# EAGLE design ph_v5 (EAGLE 7.5.0)
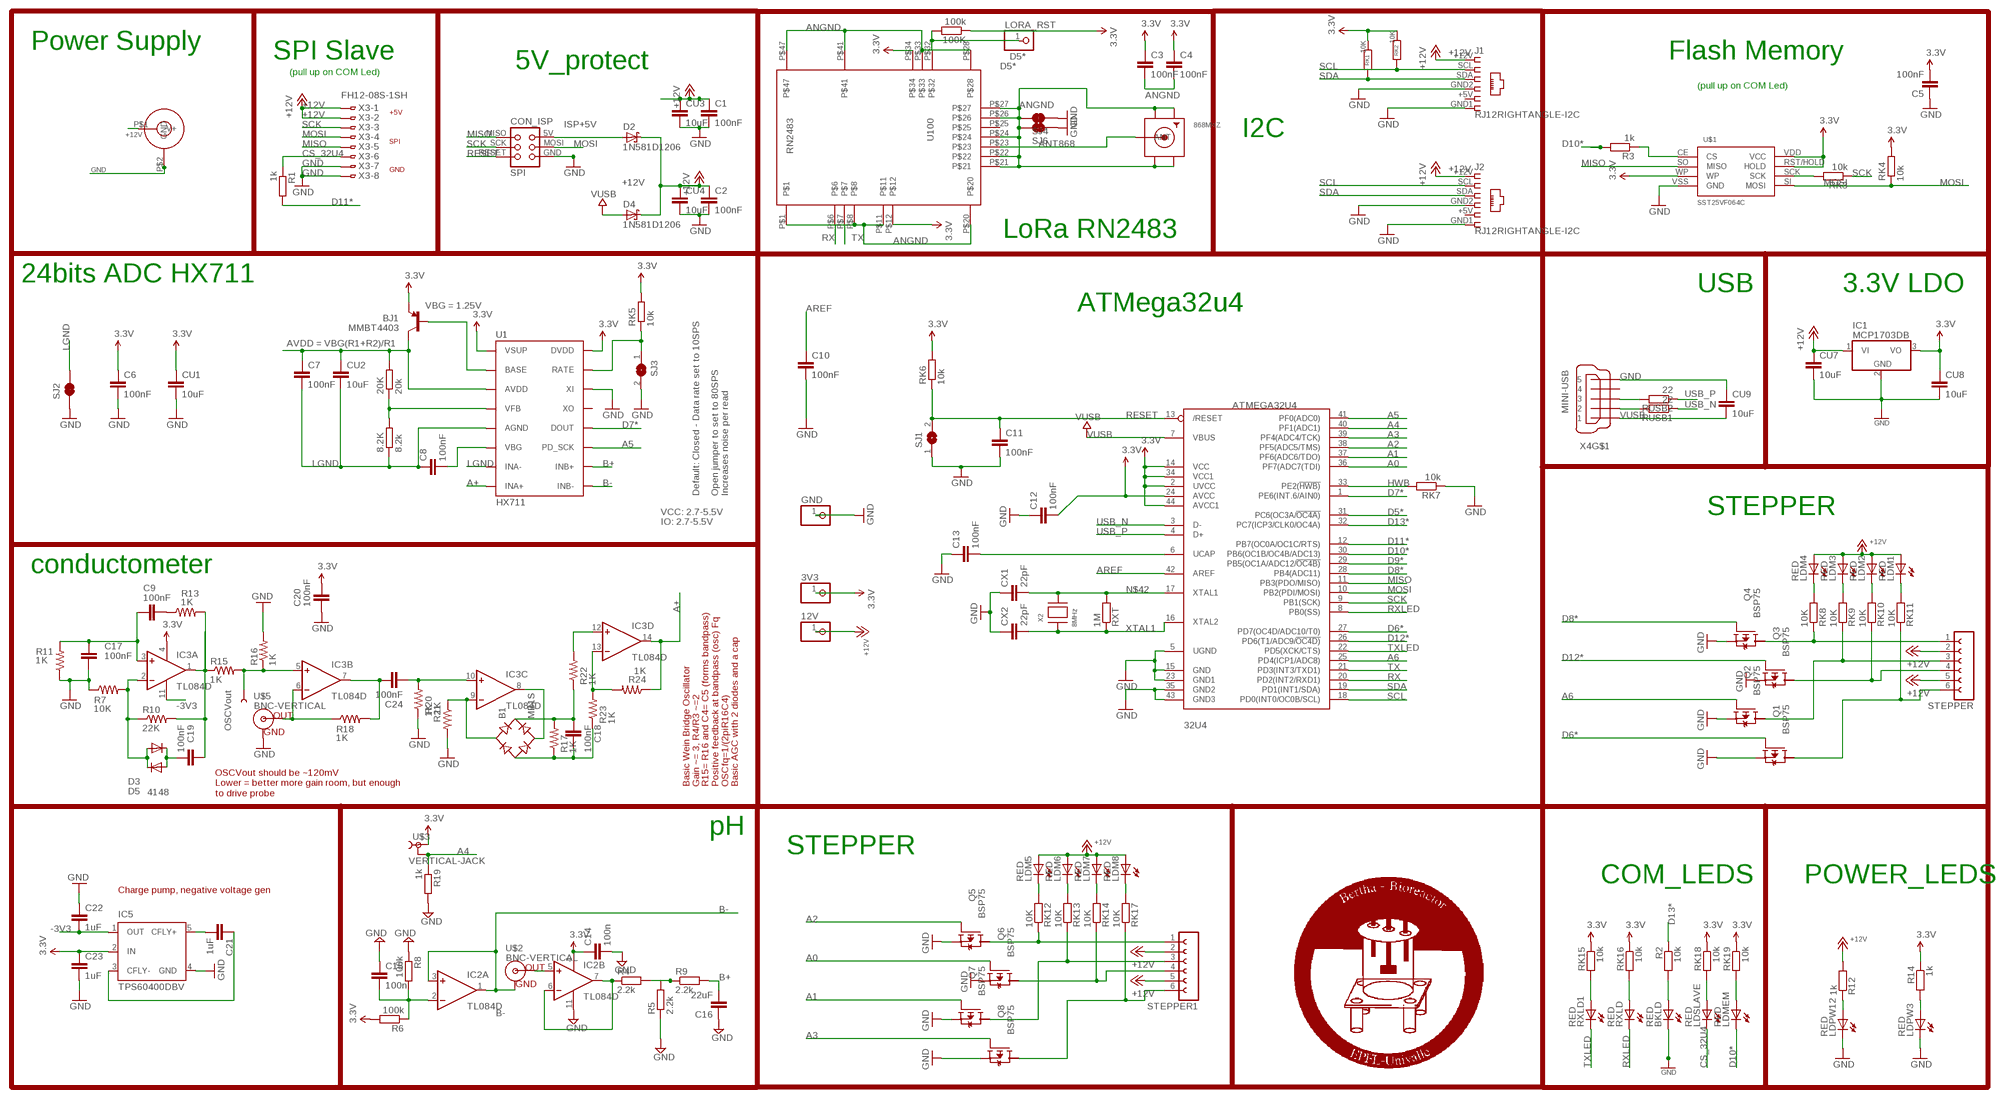
[diagram p0: schematic, sheet 1]

## Parts
3V3  PINHD-1X1  [1X01]
8.2K  8.2k  R-EU_M0805  [M0805]
12V  PINHD-1X1  [1X01]
20K  20k  R-EU_M0805  [M0805]
32U4  ATMEGA32U4  ATMEGA32U4-AU  [TQFP44]
100K  100k  R-EU_R0805  [R0805]
868MHZ  SMACONNECTOR_EDGE  [SMA_EDGELAUNCH]
B1  MB1S  [SOIC-4]
BJ1  MMBT4403  TRANSISTOR_PNPMMBT4403  [SOT23-3]
BKLD  RED  LEDCHIP-LED0805  [CHIP-LED0805]
C1  100nF  C-EUC1206  [C1206]
C2  100nF  C-EUC1206  [C1206]
C3  100nF  C-EUC1206  [C1206]
C4  100nF  C-EUC1206  [C1206]
C5  100nF  C-EUC1206  [C1206]
C6  100nF  C-EUC1206  [C1206]
C7  100nF  C-EUC1206  [C1206]
C8  100nF  C-EUC1206  [C1206]
C9  100nF  CAP1206  [1206]
C10  100nF  C-EUC1206  [C1206]
C11  100nF  C-EUC1206  [C1206]
C12  100nF  C-EUC1206  [C1206]
C13  100nF  C-EUC1206  [C1206]
C14  100n  C-EUC1206  [C1206]
C15  100n  C-EUC1206  [C1206]
C16  22uF  C-EUC1206  [C1206]
C17  100nF  CAP1206  [1206]
C18  100nF  CAP1206  [1206]
C19  100nF  CAP1206  [1206]
C20  100nF  CAP1206  [1206]
C21  1uF  CAP1206  [1206]
C22  1uF  CAP1206  [1206]
C23  1uF  CAP1206  [1206]
C24  100nF  CAP1206  [1206]
CON1  JACK_DC_BARREL  [DC_BARREL]
CON_ISP  SPI  TINYISPT  [TC2030-MCP-NL]
CU1  10uF  C-EUC1206  [C1206]
CU2  10uF  C-EUC1206  [C1206]
CU3  10uF  C-EUC1206  [C1206]
CU4  10uF  C-EUC1206  [C1206]
CU7  10uF  C-EUC1206  [C1206]
CU8  10uF  C-EUC1206  [C1206]
CU9  10uF  C-EUC1206  [C1206]
CX1  22pF  C-EUC1206  [C1206]
CX2  22pF  C-EUC1206  [C1206]
D2  1N581D1206  [LED-1206]
D3  4148  MBR0520LT  [SOD123]
D4  1N581D1206  [LED-1206]
D5  4148  MBR0520LT  [SOD123]
GND  PINHD-1X1  [1X01]
IC1  MCP1703DB  [SOT223]
IC2  TL084D  [SO14]
IC3  TL084D  [SO14]
IC5  TPS60400DBV  [SOT23-DBV]
J1  RJ12RIGHTANGLE-I2C  [RJ12-RIGHTANGLE-I2C]
J2  RJ12RIGHTANGLE-I2C  [RJ12-RIGHTANGLE-I2C]
LDM1  RED  LEDCHIP-LED0805  [CHIP-LED0805]
LDM2  RED  LEDCHIP-LED0805  [CHIP-LED0805]
LDM3  RED  LEDCHIP-LED0805  [CHIP-LED0805]
LDM4  RED  LEDCHIP-LED0805  [CHIP-LED0805]
LDM5  RED  LEDCHIP-LED0805  [CHIP-LED0805]
LDM6  RED  LEDCHIP-LED0805  [CHIP-LED0805]
LDM7  RED  LEDCHIP-LED0805  [CHIP-LED0805]
LDM8  RED  LEDCHIP-LED0805  [CHIP-LED0805]
LDMEM  RED  LEDCHIP-LED0805  [CHIP-LED0805]
LDPW3  RED  LEDCHIP-LED0805  [CHIP-LED0805]
LDPW12  RED  LEDCHIP-LED0805  [CHIP-LED0805]
LDSLAVE  RED  LEDCHIP-LED0805  [CHIP-LED0805]
LORA_RST  PINHD-1X1  [1X01]
Q1  BSP75  BSP613P  [PG-SOT-223]
Q2  BSP75  BSP613P  [PG-SOT-223]
Q3  BSP75  BSP613P  [PG-SOT-223]
Q4  BSP75  BSP613P  [PG-SOT-223]
Q5  BSP75  BSP613P  [PG-SOT-223]
Q6  BSP75  BSP613P  [PG-SOT-223]
Q7  BSP75  BSP613P  [PG-SOT-223]
Q8  BSP75  BSP613P  [PG-SOT-223]
R1  1k  R-EU_R0805  [R0805]
R2  10k  R-EU_R0805  [R0805]
R3  1k  R-EU_R0805  [R0805]
R4  2.2k  R-EU_R0805  [R0805]
R5  2.2k  R-EU_R0805  [R0805]
R6  100k  R-EU_R0805  [R0805]
R7  10K  RESISTOR0805-RES  [0805]
R8  100k  R-EU_R0805  [R0805]
R9  2.2k  R-EU_R0805  [R0805]
R10  22K  RESISTOR0805-RES  [0805]
R11  1K  RESISTOR0805-RES  [0805]
R12  1k  R-EU_R0805  [R0805]
R13  1K  RESISTOR0805-RES  [0805]
R14  1k  R-EU_R0805  [R0805]
R15  1K  RESISTOR0805-RES  [0805]
R16  1K  RESISTOR0805-RES  [0805]
R17  1K  RESISTOR0805-RES  [0805]
R18  1K  RESISTOR0805-RES  [0805]
R19  1k  R-EU_R0805  [R0805]
R20  1K  RESISTOR0805-RES  [0805]
R21  1K  RESISTOR0805-RES  [0805]
R22  1K  RESISTOR0805-RES  [0805]
R23  1K  RESISTOR0805-RES  [0805]
R24  1K  RESISTOR0805-RES  [0805]
RK1  10K  R-EU_M0805  [M0805]
RK2  10K  R-EU_M0805  [M0805]
RK3  10k  R-EU_R0805  [R0805]
RK4  10k  R-EU_R0805  [R0805]
RK5  10k  R-EU_M0805  [M0805]
RK6  10k  R-EU_M0805  [M0805]
RK7  10k  R-EU_M0805  [M0805]
RK8  10K  R-EU_R0805  [R0805]
RK9  10K  R-EU_R0805  [R0805]
RK10  10K  R-EU_R0805  [R0805]
RK11  10K  R-EU_R0805  [R0805]
RK12  10K  R-EU_R0805  [R0805]
RK13  10K  R-EU_R0805  [R0805]
RK14  10K  R-EU_R0805  [R0805]
RK15  10k  R-EU_R0805  [R0805]
RK16  10k  R-EU_R0805  [R0805]
RK17  10K  R-EU_R0805  [R0805]
RK18  10k  R-EU_R0805  [R0805]
RK19  10k  R-EU_R0805  [R0805]
RUSB1  22  R-EU_M1206  [M1206]
RUSB2  22  R-EU_M1206  [M1206]
RXLD  RED  LEDCHIP-LED0805  [CHIP-LED0805]
RXLD1  RED  LEDCHIP-LED0805  [CHIP-LED0805]
RXT  1M  R-EU_R0805  [R0805]
SJ1  SJ  [SJ]
SJ2  JUMPER-PAD-2-NC_BY_TRACE  [PAD-JUMPER-2-NC_BY_TRACE_YES_SILK]
SJ3  SJ  [SJ]
SJ4  JUMPER-PAD-2-NC_BY_TRACE  [PAD-JUMPER-2-NC_BY_TRACE_YES_SILK]
SJ6  JUMPER-PAD-2-NC_BY_TRACE  [PAD-JUMPER-2-NC_BY_TRACE_YES_SILK]
STEPPER  FE06-1  [FE06]
STEPPER1  FE06-1  [FE06]
TP5  OSCVout  TEST-POINT3  [PAD.03X.03]
U1  HX711  HX711HX711  [SO16]
U100  RN2483  [RN2483]
U$1  SST25VF064C  [SOIC_8-LEAD]
U$2  BNC-VERTICAL  [BNC-VERTICAL]
U$3  VERTICAL-JACK  [VERTICAL-JACK]
U$5  BNC-VERTICAL  [BNC-VERTICAL]
X2  8MHz  XTALNX6035  [NX6035]
X3  FH12-08S-1SH  [FH12-08S-1SH]
X4  MINI-USB  MINI-USB-SCHIELD-32005-201  [32005-201]

## Nets
3.3V [power]: 3V3.1 32U4.2(UVCC) 32U4.14(VCC) 32U4.24(AVCC) 32U4.34(VCC1) 32U4.44(AVCC1) 100K.1 BJ1.2(E) C3.1 C4.1 C5.2 C6.1 C12.2 C14.1 C20.1 C23.1 CU1.1 CU8.1 IC1.3(VO) IC2.4(P:V+) IC3.4(P:V+) IC5.2(IN) R6.2 R14.1 RK1.1 RK2.1 RK4.2 RK5.2 RK6.2 RK15.1 RK16.1 RK18.1 RK19.1 U1.1(VSUP) U1.16(DVDD) U100.P$12 U100.P$34 U$1.RST/HOLD(HOLD) U$1.VDD(VCC) U$1.WP U$3.P$1
+12V [power]: 12V.1 C1.1 C2.1 CON1.P$1(V+) CU3.1 CU4.1 CU7.1 D2.C D4.C IC1.1(VI) J1.+12V J2.+12V LDM1.A LDM2.A LDM3.A LDM4.A LDM5.A LDM6.A LDM7.A LDM8.A R12.2 STEPPER1.2 STEPPER1.5 STEPPER.2 STEPPER.5 X3.1 X3.2
-3V3: C22.2 IC3.11(P:V-) IC5.1(OUT)
A0: 32U4.36(PF7(ADC7(TDI)) Q6.1(G)
A1: 32U4.37(PF6(ADC6/TDO)) Q7.1(G)
A2: 32U4.38(PF5(ADC5/TMS)) Q5.1(G)
A3: 32U4.39(PF4(ADC4/TCK)) Q8.1(G)
A4: 32U4.40(PF1(ADC1)) R19.1 U$3.P$2
A5: 32U4.41(PF0(ADC0)) U1.11(PD_SCK)
A6: 32U4.25(PD4(ICP1/ADC8)) Q2.1(G)
A+: IC3.14(D:OUT) R24.1 U1.8(INA+)
ANGND: 868MHZ.GND@1(GND4) 868MHZ.GND@2(GND3) 868MHZ.GND@3(GND2) 868MHZ.GND@4(GND1) C3.2 C4.2 SJ4.2 SJ6.2 U100.P$1 U100.P$8 U100.P$11 U100.P$20 U100.P$21 U100.P$22 U100.P$24 U100.P$26 U100.P$27 U100.P$28 U100.P$33 U100.P$41 U100.P$47
ANT868: 868MHZ.P(ANT) U100.P$23
AREF: 32U4.42(AREF) C10.1
B+: C16.2 R9.2 U1.10(INB+)
B-: IC2.1(A:OUT) IC2.3(A:+IN) U1.9(INB-) U$2.G(GND)
CN3: C8.2 U1.6(VBG)
CS_32U4: LDSLAVE.C R1.1 X3.6
D5*: 32U4.31(PC6(OC3A/!OC4A)) 100K.2 LORA_RST.1 U100.P$32
D6*: 32U4.27(PD7(OC4D/ADC10/T0)) Q1.1(G)
D7*: 32U4.1(PE6(INT.6/AIN0)) U1.12(DOUT)
D8*: 32U4.28(PB4(ADC11)) Q4.1(G)
D9*: 32U4.29(PB5(OC1A/ADC12/!OC4B))
D10*: 32U4.30(PB6(OC1B/OC4B/ADC13)) LDMEM.C R3.2
D11*: 32U4.12(PB7(OC0A/OC1C/RTS)) R1.2
D12*: 32U4.26(PD6(T1/ADC9/!OC4D)) Q3.1(G)
D13*: 32U4.32(PC7(ICP3/CLK0/OC4A)) R2.1
GND [power]: 32U4.5(UGND) 32U4.15(GND) 32U4.23(GND1) 32U4.35(GND2) 32U4.43(GND3) BKLD.C C1.2 C2.2 C5.1 C6.2 C10.2 C11.2 C12.1 C13.1 C14.2 C15.1 C16.1 C17.1 C20.2 C22.1 C23.2 CON1.P$2(GND) CON_ISP.GND CU1.2 CU3.2 CU4.2 CU7.2 CU8.2 CU9.1 CX1.1 CX2.1 GND.1 IC1.2(GND) IC2.11(P:V-) IC5.4(GND) J1.GND1 J1.GND2 J2.GND1 J2.GND2 LDPW3.C LDPW12.C Q1.3(S) Q2.3(S) Q3.3(S) Q4.3(S) Q5.3(S) Q6.3(S) Q7.3(S) Q8.3(S) R5.1 R7.1 R8.1 R11.1 R16.2 R19.2 R20.1 R21.2 RK7.1 SJ1.1 SJ2.1 SJ3.2 SJ4.1 SJ6.1 U1.14(XI) U$1.VSS(GND) U$5.G(GND) X3.7 X3.8 X4.5
HWB: 32U4.33(PE2(!HWB)) RK7.2
ISP+5V: CON_ISP.5V(VCC) D2.A
LGND: 8.2K.1 C7.2 C8.1 CU2.2 SJ2.2 U1.5(AGND) U1.7(INA-)
MISO: 32U4.11(PB3(PDO/MISO)) CON_ISP.MISO U$1.SO(MISO) X3.5
MOSI: 32U4.10(PB2(PDI/MOSI)) CON_ISP.MOSI RK4.1 U$1.SI(MOSI) X3.4
N$1: 32U4.6(UCAP) C13.2
N$2 [power]: Q5.2(D) RK12.1 STEPPER1.1
N$3: BKLD.A R2.2
N$4 [power]: Q7.2(D) RK13.1 STEPPER1.3
N$5: 20K.2 BJ1.3(C) C7.1 CU2.1 U1.3(AVDD)
N$6 [power]: Q6.2(D) RK14.1 STEPPER1.4
N$7: LDPW12.A R12.1
N$8 [power]: Q8.2(D) RK17.1 STEPPER1.6
N$9: LDM5.C RK12.2
N$10: R3.1 U$1.CE(CS)
N$11: LDM6.C RK13.2
N$12: LDM7.C RK14.2
N$13: LDM8.C RK17.2
N$14 [power]: Q4.2(D) RK8.1 STEPPER.1
N$15 [power]: Q2.2(D) RK9.1 STEPPER.3
N$16 [power]: Q3.2(D) RK10.1 STEPPER.4
N$17: R4.2 R5.2 R9.1
N$18: D3.A D5.C IC3.2(A:-IN) R7.2 R10.1
N$19 [power]: Q1.2(D) RK11.1 STEPPER.6
N$20: C9.1 R13.1
N$21: IC2.5(B:+IN) U$2.S(OUT)
N$22: LDSLAVE.A RK18.2
N$23: RK3.2 U$1.SCK
N$24: RK16.2 RXLD.A
N$25: LDMEM.A RK19.2
N$26: C19.1 IC3.1(A:OUT) R10.2 R13.2 R15.1
N$27: C15.2 IC2.2(A:-IN) R6.1 R8.2
N$28: IC2.6(B:-IN) IC2.7(B:OUT) R4.1
N$29: IC3.5(B:+IN) R15.2 R16.1 TP5.P$1
N$30: C9.2 C17.2 IC3.3(A:+IN) R11.2
N$31: LDM4.C RK8.2
N$32: LDM3.C RK9.2
N$33: LDM2.C RK10.2
N$34: LDPW3.A R14.2
N$35: IC3.6(B:-IN) R18.1 U$5.S(OUT)
N$36: C24.1 IC3.7(B:OUT) R18.2
N$37: LDM1.C RK11.2
N$38: BJ1.1(B) U1.2(BASE)
N$39: 8.2K.2 20K.1 U1.4(VFB)
N$40: C24.2 IC3.10(C:+IN) R20.2
N$41: RK5.1 SJ3.1 U1.15(RATE)
N$42: 32U4.17(XTAL1) CX1.2 RXT.2 X2.P$2
N$43: B1.~2(AC2) IC3.8(C:OUT)
N$44: C19.2 D3.C D5.A
N$45: C21.1 IC5.3(CFLY-)
N$46: C21.2 IC5.5(CFLY+)
N$47: B1.- C18.1 R17.1 R23.1
N$48: B1.~1(AC1) IC3.9(C:-IN) R21.1
N$49: B1.+ C18.2 R17.2 R22.1
N$50: IC3.12(D:+IN) R22.2
N$51: IC3.13(D:-IN) R23.2 R24.2
N$52: RK15.2 RXLD1.A
RESET: 32U4.13(/RESET) C11.1 CON_ISP.RESET RK6.1 SJ1.2
RX: 32U4.20(PD2(INT2/RXD1)) U100.P$6
RXLED: 32U4.8(PB0(SS)) RXLD.C
SCK: 32U4.9(PB1(SCK)) CON_ISP.SCK RK3.1 X3.3
SCL: 32U4.18(PD0(INT0/OC0B/SCL)) J1.SCL J2.SCL RK2.2
SDA: 32U4.19(PD1(INT1/SDA)) J1.SDA J2.SDA RK1.2
TX: 32U4.21(PD3(INT3/TXD1)) U100.P$7
TXLED: 32U4.22(PD5(XCK/CTS)) RXLD1.C
USB_N: 32U4.3(D-) RUSB1.1
USB_P: 32U4.4(D+) RUSB2.1
USBC_N: RUSB1.2 X4.2
USBC_P: RUSB2.2 X4.3
VUSB: 32U4.7(VBUS) CU9.2 D4.A X4.1
XTAL1: 32U4.16(XTAL2) CX2.2 RXT.1 X2.P$1
Unconnected: IC2.8(C:OUT) IC2.9(C:-IN) IC2.10(C:+IN) IC2.12(D:+IN) IC2.13(D:-IN) IC2.14(D:OUT) J1.+5V J2.+5V Q1.4(D) Q2.4(D) Q3.4(D) Q4.4(D) Q5.4(D) Q6.4(D) Q7.4(D) Q8.4(D) U1.13(XO) U100.P$25 X4.4 X4.M1(S:S1) X4.M2(S:S2) X4.M3(S:S3) X4.M4(S:S4)

## Notes on the sheet
- Power Supply
- SPI Slave | Flash Memory
- 5V_protect
- (pull up on COM Led)
- (pull up on COM Led)
- +5V
- I2C
- SPI
- GND
- LoRa RN2483
- 24bits ADC HX711
- USB | 3.3V LDO
- VBG = 1.25V
- ATMega32u4
- AVDD = VBG(R1+R2)/R1
- Default: Closed - Data rate set to 10SPS
- Open jumper to set to 80SPS
  Increases noise per read
- VCC: 2.7-5.5V | STEPPER
- IO: 2.7-5.5V
- conductometer
- Basic Wein Bridge Oscillator | Gain ~= 3, R4/R3 ~=2
- R15= R16 and C4= C5 (forms bandpass)
  Positive feedback at bandpass (osc) Fq
- OSCfq=1/(2piR16C4) | Basic AGC with 2 diodes and a cap
- OSCVout should be ~120mV
  Lower = better more gain room, but enough
  to drive probe
- pH
- STEPPER
- COM_LEDS | POWER_LEDS
- Charge pump, negative voltage gen

## Library data of the parts
3V3 12V GND LORA_RST = Headerlibrary:PINHD-1X1: PIN HEADER
8.2K 20K R4-R6 R8 R9 R14 R19 RK1 RK2 RK5-RK7 RUSB1 RUSB2 = resistor:R-EU_: RESISTOR, European symbol
32U4 = adafruit:ATMEGA32U4: http://www.ladyada.net/library/eagle
100K R1-R3 R12 RK3 RK4 RK8-RK19 RXT = rcl:R-EU_: RESISTOR, European symbol
868MHZ = sma_end_launch:SMACONNECTOR: SMA Connector 90° DIP SMA Connector, 50 Ohm (4UConnector: 07259)
B1 = rectifier:MB*S: Bridge Rectifier Source: http://www.fairchildsemi.com/ds/MB/MB6S.pdf
BJ1 = SparkFun-DiscreteSemi:TRANSISTOR_PNP: Generic PNP BJT Double check pinouts against datasheets- not all devices are the same! MMBT3906 - 40V 200mA SOT-23 (TRANS-08052) MMBT4403 - 40V 600mA SOT-23 (TRANS-09245); PROD_ID: TRANS-09245
BKLD LDM1-LDM8 LDMEM LDPW3 LDPW12 LDSLAVE RXLD RXLD1 = adafruit:LED: LED OSRAM: - CHIPLED LG R971, LG N971, LY N971, LG Q971, LY Q971, LO R971, LY R971 LH N974, LH R974 LS Q976, LO Q976, LY Q976 LO Q996 - Hyper CHIPLED LW Q18S LB Q993, LB Q99A, LB R99A - SideLED LS A670, LO A670, LY A670, LG A670, LP A670 LB A673, LV A673, LT A673, LW A673 LH A674 LY A675 LS A676, LA A676, LO A676, LY A676, LW A676 LS A679, LY A679, LG A679 - Hyper Micro SIDELED® LS Y876, LA Y876, LO Y876, LY Y876 LT Y87S - SmartLED LW L88C, LW L88S LB L89C, LB L89S, LG L890 LS L89K, LO L89K, LY L89K LS L896, LA L896, LO L896, LY L896 - TOPLED LS T670, LO T670, LY T670, LG T670, LP T670 LSG T670, LSP T670, LSY T670, LOP T670, LYG T670 LG T671, LOG T671, LSG T671 LB T673, LV T673, LT T673, LW T673 LH T674 LS T676, LA T676, LO T676, LY T676, LB T676, LH T676, LSB T676, LW T676 LB T67C, LV T67C, LT T67C, LS T67K, LO T67K, LY T67K, LW E67C LS E67B, LA E67B, LO E67B, LY E67B, LB E67C, LV E67C, LT E67C LW T67C LS T679, LY T679, LG T679 LS T770, LO T770, LY T770, LG T770, LP T770 LB T773, LV T773, LT T773, LW T773 LH T774 LS E675, LA E675, LY E675, LS T675 LS T776, LA T776, LO T776, LY T776, LB T776 LHGB T686 LT T68C, LB T68C - Hyper Mini TOPLED® LB M676 - Mini TOPLED Santana® LG M470 LS M47K, LO M47K, LY M47K Source: http://www.osram.convergy.de/
C1-C8 C10-C16 CU1-CU4 CU7-CU9 CX1 CX2 = rcl:C-EU: CAPACITOR, European symbol
C9 C17-C24 = SparkysWidgets:CAP: Capacitor Standard 0603 ceramic capacitor, and 0.1" leaded capacitor.
CON1 = lpatiny:JACK_DC_BARREL
CON_ISP = lpatiny:TINYISP: CONNECTOR
D2 D4 = lpatiny:1N581*: 1.0A SCHOTTKY BARRIER RECTIFIER Source: http://www.diodes.com/datasheets/ds23001.pdf
D3 D5 = SparkysWidgets:MBR0520LT: SCHOTTKY BARRIER RECTIFIER Source: http://onsemi.com .. MBR0520LT1-D.pdf
IC1 = linear:MCP1703: 250 mA, 16V, Low Quiescent Current LDO Regulator Source: http://ww1.microchip.com/downloads/en/DeviceDoc/22049b.pdf
IC2 IC3 = linear:TL084: OP AMP
IC5 = SparkysWidgets:TPS60400DBV: UNREGULATED CHARGE PUMP VOLTAGE INVERTER 60-mA unregultated charge pump voltage inverter Source: http://focus.ti.com/lit/ds/symlink/tps6040i.pdf
J1 J2 = lpatiny:RJ12: CORCOM Modular RJ Jacks No Shield Source: www.tycoelectronics.com .. ENG_DS_1654001_1099_RJ_L_0507.pdf
Q1-Q8 = infineon:BSP613P: SIPMOS (R) Small-Signal-Transistor P-Channel (2 Drain) Source: http://www.infineon.com/dgdl/BSP613P_Rev2.4.pdf; OC_FARNELL: unknown; OC_NEWARK: unknown
R7 R10 R11 R13 R15-R18 R20-R24 = SparkysWidgets:RESISTOR: Resistor Basic schematic elements and footprints for 0603, 1206, and PTH resistors.
SJ1 SJ3 = jumper:SJ: SMD solder JUMPER
SJ2 SJ4 SJ6 = SparkFun-Passives:JUMPER-PAD-2-NC_BY_TRACE
STEPPER STEPPER1 = con-lsta:FE06-1: FEMALE HEADER; OC_FARNELL: unknown; OC_NEWARK: unknown
TP5 = SW_Passives:TEST-POINT: Bare copper test points for troubleshooting or ICT
U1 = Testing:HX711; PROD_ID: IC-12445
U100 = Octanis1:RN2483: Microchip Low-Power Long Range LoRaTM Technology Transceiver Module
U$1 = BertaLib:SST25VF064C
U$2 U$5 = phMeter:BNC-VERTICAL
U$3 = phMeter:VERTICAL-JACK
X2 = lpatiny:XTAL: Low cost SMT crystals, no capacitors included http://www.ladyada.net/library/eagle
X3 = con-hirose:FH12-08S-1S: 1mm Pitch Connectors For FPC/FFC Source: Data sheet <http://www.hirose.co.jp/cataloge_hp/e58605370.pdf>; OC_FARNELL: unknown; OC_NEWARK: unknown
X4 = con-cypressindustries:MINI-USB-SCHIELD-: MINI USB-B Conector Source: www.cypressindustries.com; OC_FARNELL: unknown; OC_NEWARK: unknown

## Net classes
0 default: width 0.203 mm, clearance 0.25 mm
1 power: width 0.203 mm, drill 0.305 mm, clearance 0.25 mm
2 VIN: width 0.457 mm, clearance 0.25 mm
3 fine: width 0.254 mm, clearance 0.25 mm
4 aref: width 0.356 mm, clearance 0.25 mm

## Board
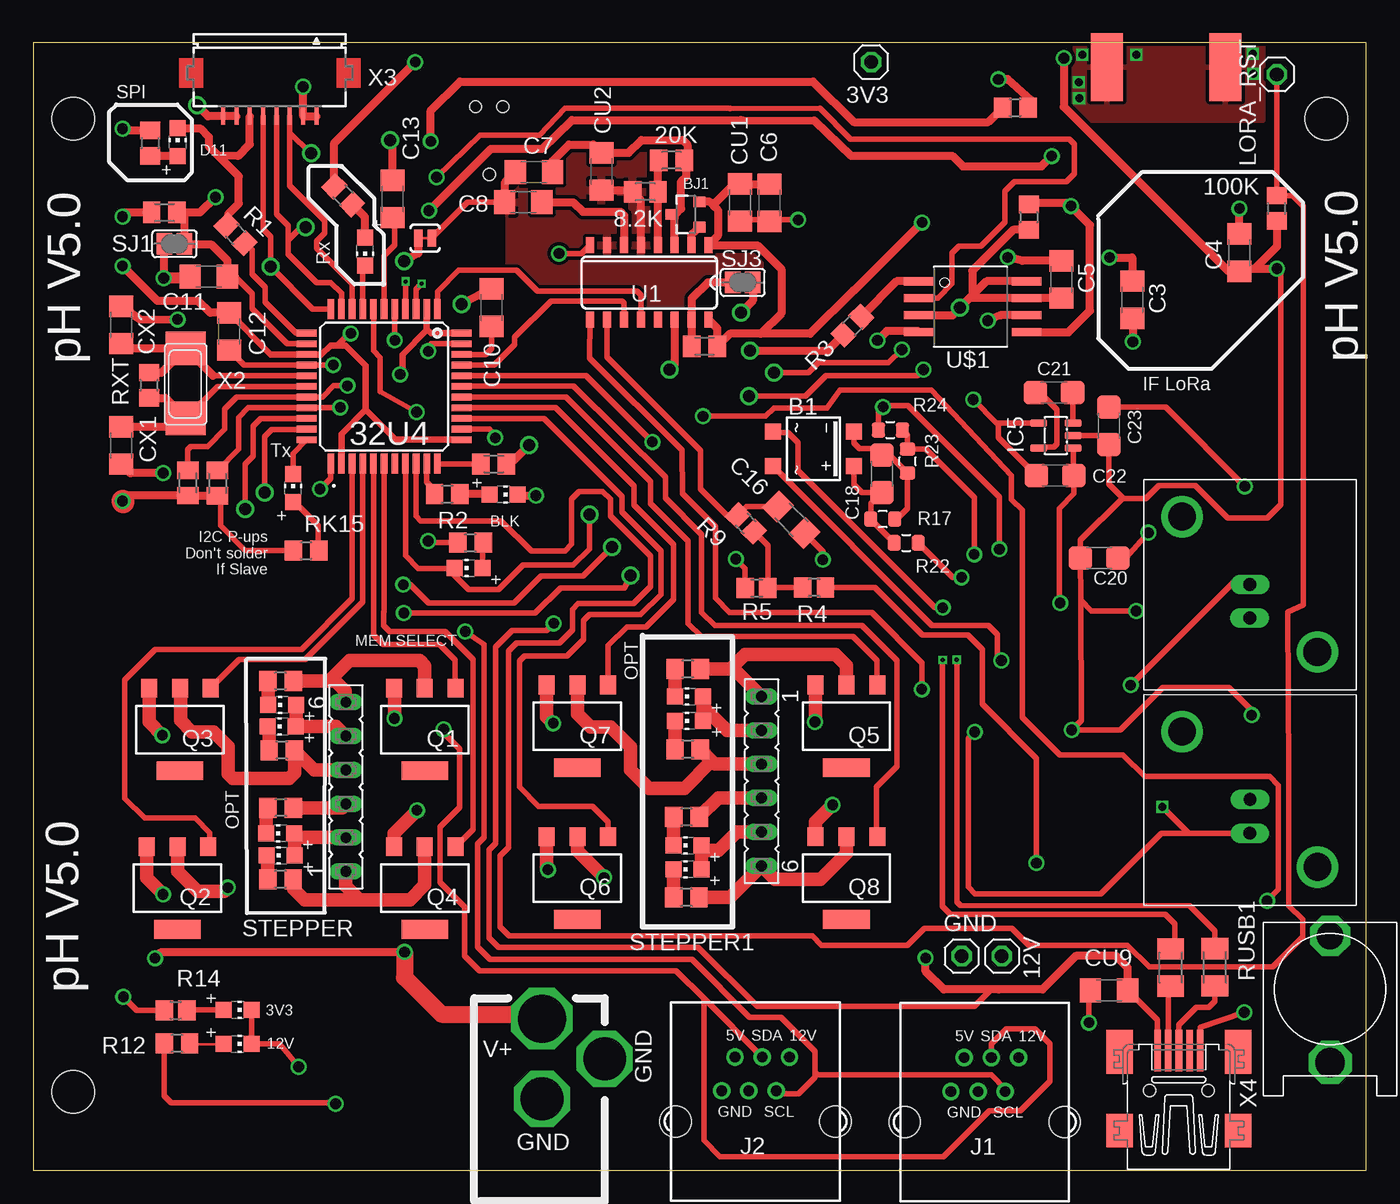
[diagram p1: board, top side]
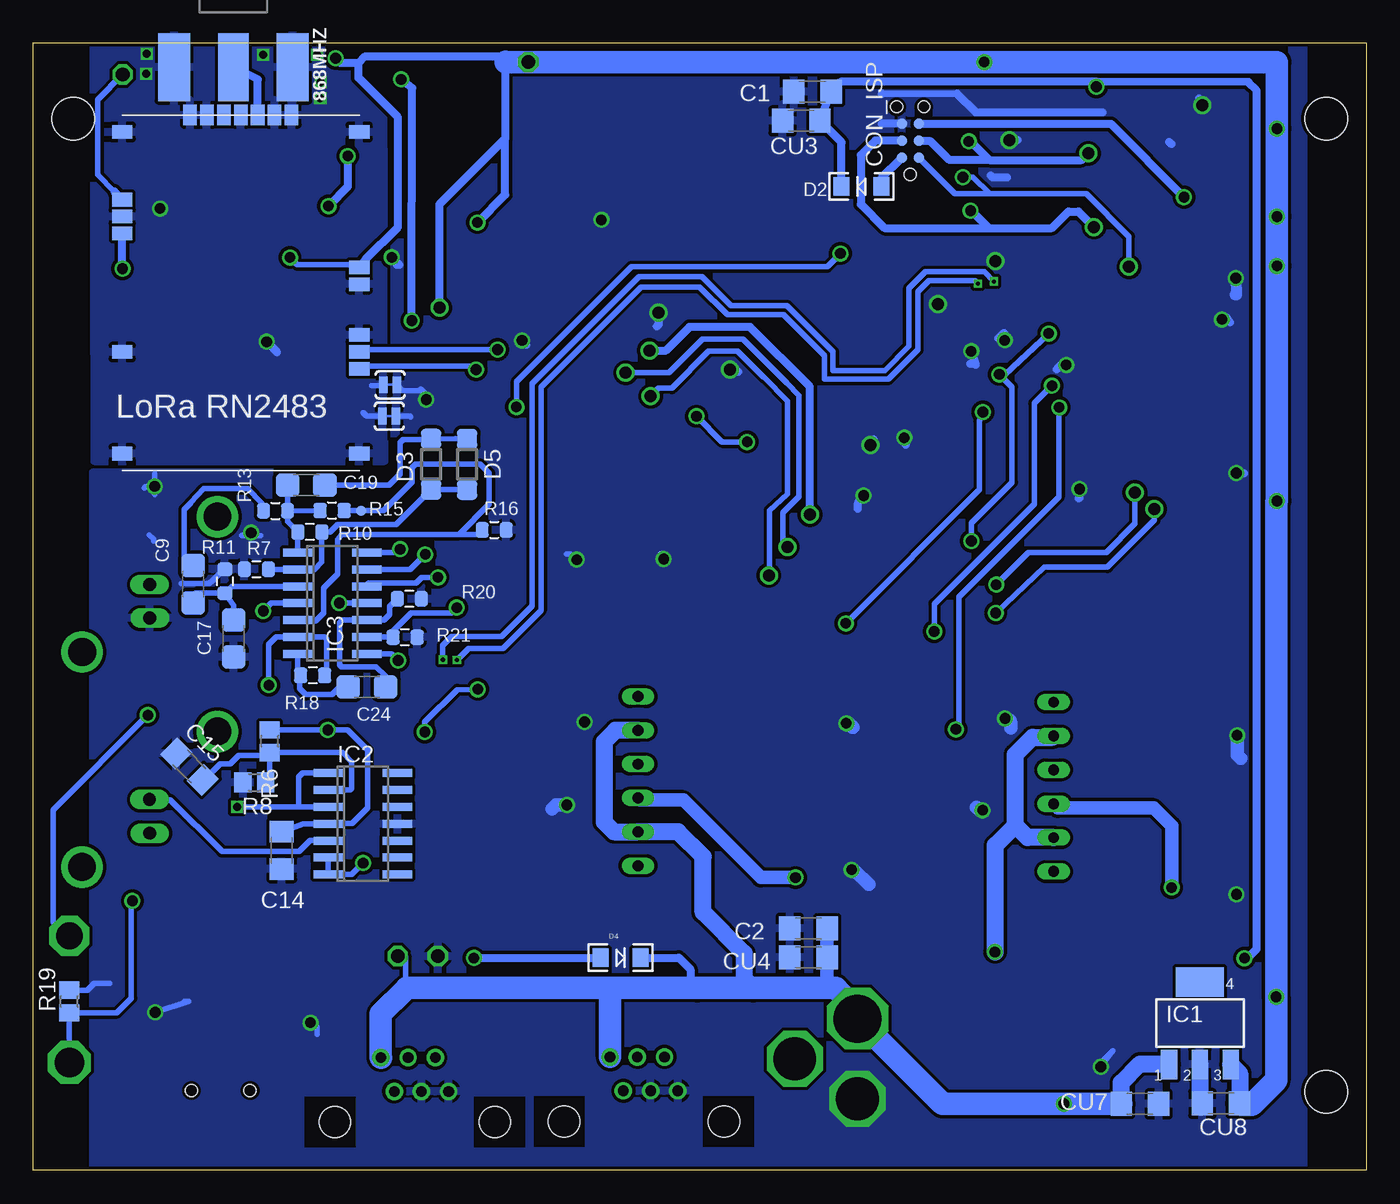
[diagram p2: board, bottom side, seen from below]

Size 100 x 84.6 mm. Coordinates in mm from the lower left corner, seen from the top.
Outline: 0,0 100,0 100,84.6 0,84.6 0,0
Copper layers (1*2*15*16): Top 0.035mm / dielectric 0.2mm / layer 2 0.0175mm / dielectric 1.1mm / layer 15 0.0175mm / dielectric 0.2mm / Bottom 0.035mm
Design rules "SeeedStudio_DRU_no_angle_20130527": minimum track width 6mil, minimum drill 12mil, track to track 6mil, track to pad 6mil, pad to pad 6mil, via to via 6mil, smd to smd 0mil, copper to edge 10mil, drill to drill 10mil, minimum pad ring 6mil, minimum via ring 6mil, stop-mask expansion 2mil, vias tented up to drill 25mil, thermal gap 10mil
Holes 3.2 mm at 3,78.9 97,78.9 3,5.9
vRestrict: area 13.7,78 to 21.9,81.8

### Footprints (pad centres in the part's own frame; a part is rotated, then mirrored left to right if it is on the bottom)
1X01 = drill 1.016 octagon: 1 0,0
M0805 = smd 1.3 x 1.6: 1 -0.95,0; 2 0.95,0
TQFP44 = smd 1.5 x 0.5: 1 -5.8,4; 2 -5.8,3.2; 3 -5.8,2.4; 4 -5.8,1.6; 5 -5.8,0.8; 6 -5.8,0; 7 -5.8,-0.8; 8 -5.8,-1.6; 9 -5.8,-2.4; 10 -5.8,-3.2; 11 -5.8,-4; 23 5.8,-4; 24 5.8,-3.2; 25 5.8,-2.4; 26 5.8,-1.6; 27 5.8,-0.8; 28 5.8,0; 29 5.8,0.8; 30 5.8,1.6; 31 5.8,2.4; 32 5.8,3.2; 33 5.8,4 | smd 0.5 x 1.5: 12 -4,-5.8; 13 -3.2,-5.8; 14 -2.4,-5.8; 15 -1.6,-5.8; 16 -0.8,-5.8; 17 0,-5.8; 18 0.8,-5.8; 19 1.6,-5.8; 20 2.4,-5.8; 21 3.2,-5.8; 22 4,-5.8; 34 4,5.8; 35 3.2,5.8; 36 2.4,5.8; 37 1.6,5.8; 38 0.8,5.8; 39 0,5.8; 40 -0.8,5.8; 41 -1.6,5.8; 42 -2.4,5.8; 43 -3.2,5.8; 44 -4,5.8
R0805 = smd 1.3 x 1.5: 1 -0.95,0; 2 0.95,0
SMA_EDGELAUNCH = smd 5.08 x 2.413: GND@1 2.54,-4.445; GND@2 2.54,4.445 | smd 5.08 x 2.413 bottom: GND@3 2.54,4.445; GND@4 2.54,-4.445 | smd 5.08 x 2.286: P 2.54,0
SOIC-4 = smd 1.2 x 1.2: + 1.3,3.05; - -1.3,3.05; ~1 -1.3,-3.05; ~2 1.3,-3.05
SOT23-3 = smd 0.8 x 0.9: 1 -0.95,-1; 2 0.95,-1; 3 0,1.1
CHIP-LED0805 = smd 1.2 x 1.2: A 0,-1.05; C 0,1.05
C1206 = smd 1.6 x 1.8: 1 -1.4,0; 2 1.4,0
1206 = smd 1.778 x 1.778: 1 -1.4,0; 2 1.4,0
DC_BARREL = drill 3.6 pad 4.5 octagon: P$1 0,13.7 | drill 3.2 pad 4.064 octagon: P$2 0,7.7; P$3 4.7,10.7
TC2030-MCP-NL = smd 0.787 x 0.787: 5V 1.27,0.635; GND 3.81,0.635; MISO 1.27,-0.635; MOSI 2.54,0.635; RESET 3.81,-0.635; SCK 2.54,-0.635 | hole 0.889: 0,0; 5.08,-1.016; 5.08,1.016
LED-1206 = smd 1.2 x 1.4: A -1.5,0; C 1.5,0
SOD123 = smd 1.524 x 1.524: A 1.9,0; C -1.9,0
SOT223 = smd 1.219 x 2.235: 1 -2.311,-3.099; 2 0,-3.099; 3 2.311,-3.099 | smd 3.6 x 2.2: 4 0,3.099
SO14 = smd 0.6 x 2.2: 1 -3.81,-2.6; 2 -2.54,-2.6; 3 -1.27,-2.6; 4 0,-2.6; 5 1.27,-2.6; 6 2.54,-2.6; 7 3.81,-2.6; 8 3.81,2.6; 9 2.54,2.6; 10 1.27,2.6; 11 0,2.6; 12 -1.27,2.6; 13 -2.54,2.6; 14 -3.81,2.6
SOT23-DBV = smd 0.55 x 1.27: 1 -0.95,-1.3; 2 0,-1.3; 3 0.95,-1.3; 4 0.95,1.3; 5 -0.95,1.3
RJ12-RIGHTANGLE-I2C = drill 0.8 pad 1.3: +5V -1.54,4.84; +12V 2.54,4.84; GND1 -2.54,2.3; GND2 -0.5,2.3; SCL 1.54,2.3; SDA 0.5,4.84 | hole 2.36: -6,0; 6,0
PG-SOT-223 = smd 1.2 x 1.4: 1 -2.311,-3.099; 2 0,-3.099; 3 2.311,-3.099 | smd 3.5 x 1.4: 4 0,3.099
R0805' = smd 1.3 x 1.5: 1 -0.85,0; 2 0.85,0
0805 = smd 0.984 x 1.143: 1 -0.9,0; 2 0.9,0
M1206 = smd 1.6 x 2: 1 -1.4,0; 2 1.4,0
SJ = smd 1.168 x 1.6: 1 -0.762,0; 2 0.762,0
PAD-JUMPER-2-NC_BY_TRACE_YES_SILK = smd 0.635 x 1.27: 1 -0.508,0; 2 0.508,0
FE06 = drill 0.813 long: 1 -6.35,0; 2 -3.81,0; 3 -1.27,0; 4 1.27,0; 5 3.81,0; 6 6.35,0
PAD.03X.03 = smd 0.762 x 0.762: P$1 0,0
SO16 = smd 0.6 x 1.2: 1 -4.445,-2.8; 2 -3.175,-2.8; 3 -1.905,-2.8; 4 -0.635,-2.8; 5 0.635,-2.8; 6 1.905,-2.8; 7 3.175,-2.8; 8 4.445,-2.8; 9 4.445,2.8; 10 3.175,2.8; 11 1.905,2.8; 12 0.635,2.8; 13 -0.635,2.8; 14 -1.905,2.8; 15 -3.175,2.8; 16 -4.445,2.8
RN2483 = smd 1.524 x 1.016: P$1 17.78,1.27; P$6 17.78,7.62; P$7 17.78,8.89; P$8 17.78,10.16; P$11 17.78,13.97; P$12 17.78,15.24; P$20 17.78,25.4; P$28 0,25.4; P$32 0,20.32; P$33 0,19.05; P$34 0,17.78; P$41 0,8.89; P$47 0,1.27 | smd 1.016 x 1.524: P$21 12.7,26.67; P$22 11.43,26.67; P$23 10.16,26.67; P$24 8.89,26.67; P$25 7.62,26.67; P$26 6.35,26.67; P$27 5.08,26.67
SOIC_8-LEAD = smd 0.61 x 2.21: CE -1.905,-2.934; RST/HOLD -0.635,5.156; SCK 0.635,5.156; SI 1.905,5.156; SO -0.635,-2.934; VDD -1.905,5.156; VSS 1.905,-2.934; WP 0.635,-2.934
BNC-VERTICAL = drill 0.97 long: G 5.4,-7.94; S 7.92,-7.96 | drill 2.09: P$3 13.02,-2.86; P$4 2.86,-13.02
VERTICAL-JACK = drill 2 octagon: P$1 5,-1 | drill 2.2 octagon: P$2 5,-10.5
NX6035 = smd 2.5 x 3: P$1 2.665,0; P$2 -2.565,0
FH12-08S-1SH = smd 0.3 x 1.3: 1 -3.5,3.25; 2 -2.5,3.25; 3 -1.5,3.25; 4 -0.5,3.25; 5 0.5,3.25; 6 1.5,3.25; 7 2.5,3.25; 8 3.5,3.25
32005-201 = smd 3.1 x 0.5: 1 3,1.6; 2 3,0.8; 3 3,0; 4 3,-0.8; 5 3,-1.6 | smd 2.5 x 2: M1 -3,-4.45; M2 -3,4.45 | smd 3.3 x 2: M3 2.9,4.45; M4 2.9,-4.45 | hole 0.9: 0,2.2; 0,-2.2

### Placement (x,y rotation side)
3V3  62.86,83.14 180 top
8.2K  45.92,73.41 0 top
12V  72.67,16.06 0 top
20K  47.88,75.77 0 top
32U4  26.31,58.81 270 top
100K  93.29,72.16 90 top
868MHZ  84.99,85.3 270 bottom
B1  58.53,54.12 270 top
BJ1  48.97,71.71 90 top
BKLD  35.29,50.7 270 top
C1  41.55,80.92 180 bottom
C2  41.85,18.15 180 bottom
C3  82.44,65.31 270 top
C4  90.48,68.84 90 top
C5  77.11,66.84 270 top
C6  55.23,72.58 270 top
C7  37.55,74.88 180 top
C8  36.76,72.63 0 top
C9  88.01,43.97 270 bottom
C10  34.4,64.71 90 top
C11  13.17,67.04 180 top
C12  14.68,62.93 90 top
C13  26.94,72.87 270 top
C14  81.35,24 270 bottom
C15  88.3,30.28 315 bottom
C16  56.87,48.79 135 top
C17  84.97,39.89 90 bottom
C18  63.67,52.25 270 top
C19  79.53,51.41 0 bottom
C20  79.96,45.93 0 top
C21  76.58,58.33 180 top
C22  76.66,52.12 0 top
C23  80.7,55.85 90 top
C24  74.97,36.25 0 bottom
CON1  38.16,-2.34 0 top
CON_ISP  34.21,74.71 90 bottom
CU1  53.03,72.61 270 top
CU2  42.62,74.94 270 top
CU3  42.39,78.74 180 bottom
CU4  41.84,15.97 180 bottom
CU7  16.97,4.98 0 bottom
CU8  10.89,5.02 180 bottom
CU9  80.71,13.51 0 top
CX1  6.6,54.38 90 top
CX2  6.6,63.42 270 top
D2  37.87,73.81 180 bottom
D3  70.15,52.97 270 bottom
D4  55.96,15.95 0 bottom
D5  67.46,52.95 90 bottom
GND  69.65,16.06 0 top
IC1  12.47,11.02 0 bottom
IC2  75.28,25.99 270 bottom
IC3  77.57,42.54 270 bottom
IC5  76.72,55.12 90 top
J1  71.38,3.61 0 top
J2  54.19,3.66 0 top
LDM1  18.66,34.91 90 top
LDM2  18.65,33.29 90 top
LDM3  18.53,25.28 90 top
LDM4  18.56,23.6 90 top
LDM5  49.2,35.54 90 top
LDM6  49.2,33.72 90 top
LDM7  49.07,24.35 90 top
LDM8  49.07,22.59 90 top
LDMEM  32.64,45.16 90 top
LDPW3  15.34,12.03 270 top
LDPW12  15.34,9.47 270 top
LDSLAVE  10.83,77.12 0 top
LORA_RST  93.29,82.22 0 top
Q1  29.37,33.06 180 top
Q2  10.82,21.17 180 top
Q3  11.01,33.06 180 top
Q4  29.37,21.17 180 top
Q5  61,33.31 180 top
Q6  40.82,21.92 180 top
Q7  40.82,33.31 180 top
Q8  61,21.92 180 top
R1  15.17,70.23 315 top
R2  31.05,50.72 0 top
R3  61.45,63.37 225 top
R4  2.2k  [R0805']  58.58,43.71 180 top
R5  2.2k  [R0805']  54.26,43.67 0 top
R6  100k  [R0805']  82.26,32.18 90 bottom
R7  83.27,45.09 0 bottom
R8  100k  [R0805']  83.42,29.09 0 bottom
R9  2.2k  [R0805']  53.45,48.52 135 top
R10  79.26,47.89 180 bottom
R11  85.63,44.19 270 bottom
R12  10.78,9.51 180 top
R13  81.83,49.47 0 bottom
R14  1k  [R0805']  10.68,12 0 top
R15  77.58,49.5 0 bottom
R16  65.42,48.04 0 bottom
R17  63.73,48.86 180 top
R18  79.04,37.13 180 bottom
R19  1k  [R0805']  97.3,12.66 90 bottom
R20  71.79,42.87 180 bottom
R21  72.11,39.99 0 bottom
R22  65.5,47.07 0 top
R23  65.59,53.2 90 top
R24  64.3,55.53 0 top
RK1  13.82,51.55 90 top
RK2  11.6,51.56 90 top
RK3  73.68,79.73 0 top
RK4  74.69,71.5 270 top
RK5  50.36,61.81 0 top
RK6  9.84,71.86 180 top
RK7  34.54,52.98 180 top
RK8  18.54,21.82 180 top
RK9  18.56,27.2 180 top
RK10  18.64,31.51 180 top
RK11  18.55,36.71 180 top
RK12  49.1,37.6 180 top
RK13  49.09,31.57 180 top
RK14  49.01,26.49 180 top
RK15  20.47,46.49 0 top
RK16  23.25,73.15 315 top
RK17  49,20.46 180 top
RK18  8.76,77.06 270 top
RK19  32.8,47.08 0 top
RUSB1  85.33,15.2 270 top
RUSB2  88.65,15.23 270 top
RXLD  24.88,68.93 180 top
RXLD1  19.48,51.18 0 top
RXT  8.68,58.89 270 top
SJ1  10.59,69.5 0 top
SJ2  29.39,69.93 0 top
SJ3  53.22,66.61 0 top
SJ4  73.23,58.93 180 bottom
SJ6  73.3,56.57 180 bottom
STEPPER  23.45,28.76 90 top
STEPPER1  54.64,29.19 270 top
TP5  75.41,49.48 0 bottom
U1  46.22,66.61 180 top
U100  93.33,52.5 0 bottom
U$1  69.37,64.79 270 top
U$2  83.33,19.89 90 top
U$3  92.29,18.58 0 top
U$5  83.32,36.02 90 top
X2  11.43,58.99 90 top
X3  17.75,82.33 180 top
X4  85.94,5.98 90 top

### Tracks (layer width: path | path; a pad name or v marks a point on that pad's centre or on a via)
3.3V  (via drill 0.8, 0.8 pad 0.81, 0.9 pad 0.61)
  Top 0.406: 20.53,61.21 32U4.14 | R14.1 7.77,12 v6.76,13.01 | RK19.1 29.73,47.1 v29.62,47.2 | 78.58,42.77 78.63,33.76 v77.91,33.03 81.58,33.03 84.75,36.21 89.7,36.21 91.4,34.51 v91.4,34.15 | 78.58,42.77 C20.1 78.56,47.27 81.7,50.4 81.79,50.4 | v82.74,41.96 79.39,41.96 78.58,42.77 | 81.79,50.4 83.48,50.4 84.45,51.37 87.17,51.37 89.6,48.94 92.58,48.94 93.6,49.96 93.6,67.35 v93.3,67.65 93.4,67.55 | IC5.2 80.03,55.12 C23.1 80.7,51.49 81.79,50.4 | RK15.1 15.91,46.49 14.04,48.36 14.04,50.38 RK1.1
  Top 0.5: 32U4.14 17.8,61.21 C12.2 | 24.93,57.06 23.11,55.24 32U4.24 | 24.93,57.06 24.93,60.39 23.44,61.88 22.81,61.88 | 22.81,61.88 22.3,61.88 21.58,61.21 20.53,61.21 | 32U4.34 27.18,54.81 24.93,57.06 | 32U4.44 29.83,62.81 29.52,63.12 | 32U4.2 29.52,63.12 | 29.52,63.12 29.52,63.02 27.7,61.2 27.7,59.89 v27.52,59.71 | 23.81,62.88 22.81,61.88
  Top 0.61: U$1.WP 68.97,64.15 v69.52,64.7 | U$1.VDD 71.51,66.69 70.46,65.64 | 70.46,65.64 v69.52,64.7 | v69.52,64.7 70.24,65.42 U$1.RST/HOLD 74.54,65.44 C5.2 | RK4.2 73.53,70.55 70.46,67.48 70.46,65.64 | 91.65,67.65 90.69,67.65 arc90 C4.1 89.66,67.44 77.32,79.78 v77.32,83.43 | 91.65,67.65 v93.3,67.65 | 93.32,69.32 93.29,69.29 | 93.29,69.29 91.65,67.65 | 100K.1 93.29,69.29 | v23.81,62.78 23.81,62.88 | 54.59,62.76 58.28,62.76 61.52,66 61.58,66 v66.68,71.11 | 54.59,62.76 52.26,62.76 RK5.2 51.31,63.16 U1.16 | 54.59,62.76 56.11,64.29 56.11,67.62 54.32,69.41 U1.1 51.36,70.1 51.36,72.05 51,72.42 | 51,72.42 50.75,72.66 BJ1.2 | 51,72.42 52.59,74.01 CU1.1 53.06,73.98 C6.1 | RK6.2 6.7,71.86 v6.7,71.55 | C12.2 13.27,64.33 12.38,65.22 9.32,65.22 v6.7,67.84 | RK18.1 6.7,78.01 v6.7,78.15 | RK1.1 13.81,50.61 RK2.1 7.11,50.61 v6.7,50.21 | RK16.1 22.58,77.06 v28.66,83.14 | v80.74,68.48 82.44,68.48 C3.1
  Top 1.676: v6.7,50.21 6.76,50.14
  Bottom 0.203: 3V3.1 62.91,83.22 62.77,83.14
  Bottom 0.406: v27.52,59.71 26.57,58.77 26.57,51.61 29.62,48.56 v29.62,47.2 | IC2.4 79.76,25.99 C14.1 | 77.86,26 IC2.4 | R6.2 v77.91,33.03 76.42,33.03 74.91,31.53 74.91,27.19 76.08,26.02 77.85,26.02 IC2.4 | v82.74,41.96 82.16,42.54 IC3.4 | v91.4,34.15 98.53,27.03 98.53,18.6 97.5,17.58 U$3.P$1 | v80.74,68.48 80.2,67.94 75.75,67.94 U100.P$12
  Bottom 0.5: v27.52,59.71 27.11,59.71 v23.81,62.78
  Bottom 0.61: v69.52,64.7 69.52,72.48 64.59,77.41 | U100.P$12 75.06,68.34 72.65,70.76 72.65,78.99 75.61,81.95 75.61,83.06 | 75.61,83.06 75.1,83.57 63.2,83.57 62.77,83.14 | 64.59,77.41 64.59,82.9 64.36,83.14 | v80.74,68.48 80.86,68.34 | v93.3,67.65 arc90 93.33,67.67 U100.P$34 | 75.61,83.06 76.95,83.06 v77.32,83.43 | v66.68,71.11 64.59,73.19 64.59,77.41
  Bottom 1.27: IC1.3 9.49,7.25 CU8.1
  Bottom 1.676: 64.55,83.15 64.55,83.14 64.36,83.14 62.77,83.14 v28.66,83.14 6.7,83.14 v6.7,78.15 v6.7,71.55 v6.7,67.84 v6.7,50.21 6.76,50.14 v6.76,13.01 6.76,6.73 8.6,4.89 9.36,4.89 CU8.1
+12V  (via drill 0.8)
  Top 0.406: R12.2 9.82,5.58 10.36,5.05 22.61,5.05 v22.68,4.98
  Top 0.61: X3.1 X3.2 20.25,79.84 v20.24,81.29 | v9.13,15.9 9.6,16.37 v27.85,16.37
  Top 1.016: STEPPER.5 22.73,33.29 LDM2.A LDM1.A | LDM4.A 19.61,25.25 LDM3.A 19.91,24.95 STEPPER.2 | LDM5.A | LDM5.A 50.25,34.8 | 50.25,34.8 LDM6.A | LDM7.A | LDM7.A LDM8.A | STEPPER1.2 52.05,33 50.25,34.8 | STEPPER1.5 52.79,25.38 51.41,24 50.47,24 LDM7.A
  Top 1.27: v27.85,16.37 27.85,14.46 30.62,11.7 37.83,11.7 CON1.P$1
  Bottom 0.406: 12V.1 arc-90 72.06,15.99 72.06,13.58
  Bottom 0.61: D2.C 39.37,77.12 CU3.1 C1.1 39.43,81.65 20.17,81.65 | 20.17,81.65 8.86,81.64 8.83,81.64 8.25,81.06 8.23,16.58 8.91,15.9 v9.13,15.9 | 20.17,81.65 20.17,81.37 v20.24,81.29 | D4.C 51.57,15.95 50.7,15.08 50.7,14.19 50.18,13.67
  Bottom 1.016: C2.1 CU4.1 40.44,14.34 39.5,13.39
  Bottom 1.27: STEPPER.2 25.41,24.95 26.34,25.87 | 26.34,25.87 26.34,31.18 25.03,32.48 23.54,32.48 STEPPER.5 | v27.85,16.37 27.83,16.39 27.83,24.38 26.34,25.87 | CU7.1 18.37,6.57 16.97,7.97 14.83,7.97 IC1.1 | STEPPER1.2 56.32,33 57.18,32.14 57.18,26.13 56.44,25.39 STEPPER1.5 51.62,25.39 49.76,23.53 49.76,19.34 49.73,19.34 46.68,16.28 46.68,14.38 46.55,14.24 45.97,13.67
  Bottom 1.676: 56.74,13.67 50.18,13.67 45.97,13.67 39.77,13.67 39.5,13.39 38.16,12.05 CON1.P$1 31.78,4.98 v22.68,4.98 CU7.1 | 56.74,13.67 71.98,13.67 72.06,13.58 73.93,11.72 J1.+12V | J2.+12V 56.73,13.65 56.74,13.67
-3V3  (via drill 0.8)
  Top 0.406: IC5.1 78.02,52.16 C22.2 78.06,50.76 76.97,49.66 76.97,42.63 v77.04,42.56
  Bottom 0.406: IC3.11 77.03,42.54 v77.04,42.56
A0
  Top 0.406: Q6.1 43.12,25.03 43.12,26.13 41.95,27.3 37.91,27.3 36.48,28.74 36.48,38.19 36.86,38.58 40.04,38.58 41.27,39.81 41.27,41.24 41.71,41.68 45.57,41.68 47.08,43.19 47.08,46.46 44.17,49.37 44.17,50.56 38.33,56.41 32U4.36
A1
  Top 0.406: Q7.1 43.14,39.35 44.55,40.76 45.98,40.76 48.03,42.81 48.03,46.94 45.06,49.91 45.06,51.31 39.17,57.21 32U4.37
A2
  Top 0.406: 63.27,36.45 Q5.1 63.3,36.42 63.3,38.24 61.49,40.05 50.12,40.05 49.12,41.04 49.12,47.22 46.33,50.02 46.33,51.65 39.97,58.01 32U4.38
A3
  Top 0.406: 32U4.39 32.19,58.81 40.54,58.81 47.42,52.01 47.42,50.43 50.15,47.69 50.15,41.86 51.14,40.87 62.17,40.87 64.8,38.24 64.8,30.28 63.27,28.74 63.27,25.07 Q8.1 63.27,25.06
A4  (via drill 0.8)
  Top 0.406: v92.57,20.21 93.42,21.05 93.42,28.87 92.76,29.53 83.39,29.53 81.75,31.17 77.01,31.17 74.2,33.98 74.2,49.52 73.39,50.33 73.39,52.14 67.38,58.52 60.51,58.52 59.55,57.19 55.56,57.19 54.94,56.56 v50.25,56.56 | v46.45,54.65 41.49,59.61 32U4.40
  Bottom 0.406: U$3.P$2 R19.1 93.74,11.81 92.65,12.9 92.65,20.14 v92.57,20.21 | v50.25,56.56 48.33,54.65 v46.45,54.65
A5
  Top 0.406: 32U4.41 34.58,60.41 36.11,61.94 36.11,62.5 38.84,65.22 44.17,65.22 44.31,65.07 U1.11
A6
  Top 0.406: Q2.1 13.25,24.38 13.25,25.32 12.14,26.42 8.34,26.42 6.86,27.9 6.86,36.8 9.15,39.08 20.11,39.08 23.91,42.88 32U4.25
A+  (via drill 0.8)
  Top 0.406: v39.44,68.78 41.15,68.78 U1.8 | R24.1 63.4,56.91 v63.75,57.26 63.85,57.36 65.62,57.36 72.49,50.49 v72.49,46.6
  Bottom 0.406: v63.75,57.26 63.73,59.18 55.12,67.79 40.43,67.79 v39.44,68.78 | IC3.14 72.73,46.35 v72.49,46.6
ANGND  (via drill 0.6, 0.8)
  Top 0.61: C3.2 82.5,63.85 v82.5,62.15 | C4.2 arc90 C4.2 v90.49,72.16
  Bottom 0.406: SJ6.2 75,56.57 75.26,56.83 | SJ4.2 73.79,58.87 74.62,58.87
  Bottom 0.61: v82.5,62.15 81.71,61.37 | v90.49,72.16 arc-90 90.41,72.23 | 90.41,72.23
  other vias: 82.76,83.71 78.46,80.43 78.43,81.64 78.71,83.69 91.5,83.76 91.53,82.28
  pour Bottom (rank 2): 73.82,85.13 95.5,85.13 95.44,53.22 73.64,53.22 73.73,84.51
  pour Top: 78.01,84.86 92.23,84.77 92.23,78.78 77.68,78.78 77.64,84.71 77.68,84.86 77.86,84.89
ANT868
  Bottom 0.61: U100.P$23 83.17,81.84 868MHZ.P
AREF
  Top 0.406: 32U4.42 33.93,61.21 33.94,61.2 34.4,61.65 C10.1
B+
  Top 0.406: C16.2 53.51,49.78 R9.2 52.03,49.12 50.06,51.09 50.06,54 43.04,61.02 U1.10
B-  (via drill 0.6, 0.8)
  Top 0.406: v66.66,36.07 66.65,38.07 62.93,41.85 52.24,41.85 51.18,42.91 51.18,48.28 48.7,50.76 48.68,54.02 41.75,60.94 U1.9 | v70.63,32.88 70.15,32.4 70.15,21.24 70.66,20.73 80.09,20.73 84.64,25.29 86.7,25.29 | U$2.G 89.26,25.29 86.7,25.29 | v84.72,27.26 86.7,25.29
  Bottom 0.406: v66.66,36.07 68.2,36.05 70.63,33.62 v70.63,32.88 | IC2.3 80.04,27.26 | 80.04,27.26 v84.72,27.26 | IC2.1 79.79,29.8 80.1,29.5 80.1,27.32 80.04,27.26
CN3
  Top 0.61: 44.35,69.44 U1.6 44.33,69.43 44.33,71.63 44.06,71.91 41.23,71.91 40.5,72.63 C8.2
CS_32U4
  Top 0.61: 13.87,76.11 15.37,76.09 16.25,76.97 X3.6 | LDSLAVE.C 12.5,78.17 13.16,77.51 13.16,76.83 13.87,76.11 | R1.1 14.64,71.76 15.41,72.53 15.41,74.58 13.87,76.11
D5*
  Top 0.406: LORA_RST.1 100K.2 94.51,73.11 95.28,72.34 | 32U4.31 28.71,49.07 29.07,48.71 35.11,48.71 37.37,46.45 39.88,46.45 40.4,46.97 40.4,50.37 40.95,50.92 42.72,50.92 43.3,50.34 43.3,49.1 46.32,46.08 46.32,43.81 45.01,42.5 40.89,42.5 40.46,42.07 40.46,40.54 39.49,39.57 36.27,39.57 35.65,38.94 35.65,24.21 35.02,23.58 35.02,18.26 35.7,17.58 58.44,17.58 59.14,16.88 65.59,16.88 66.85,18.15 73.42,18.15 74.69,16.88 82.1,16.88 83.73,15.24 92.99,15.24 95.25,17.5 95.25,18.8 94.2,19.85 94.2,29.73 94.13,41.87 95.28,42.42 95.28,72.34 | 95.28,72.34 95.29,72.34
  Top 0.61: LORA_RST.1
  Bottom 0.406: 93.93,73.42 95.19,74.68 95.19,80.33 LORA_RST.1
  Bottom 0.61: U100.P$32 93.93,73.42
D6*
  Top 0.406: Q1.1 31.65,36.2 31.65,38.26 30.48,39.43 30.47,39.43 26.26,39.43 25.52,40.17 32U4.27
D7*
  Top 0.406: 32U4.1 30.32,65.93 31.91,67.53 36.24,67.53 37.83,65.94 45.3,65.94 45.58,65.66 U1.12
D8*
  Top 0.406: Q4.1 32.98,25.57 32.98,38.33 30.89,40.42 26.74,40.42 26.28,40.88 26.28,41.87 26.32,41.9 32U4.28
D10*  (via drill 0.9 pad 0.61)
  Top 0.406: 32U4.30 27.91,46.12 28.88,45.15 31.09,45.15 | 31.09,45.15 LDMEM.C | v41.73,49.2 41.73,46.62 40.51,45.39 36.73,45.39 34.91,43.58 32.67,43.58 31.09,45.15
  Top 0.61: v53.78,61.51 59.6,61.51 R3.2
  Bottom 0.61: v41.73,49.2 41.73,58.78 46.22,63.27 50.78,63.27 52.53,61.51 v53.78,61.51
D11*
  Top 0.406: 32U4.12 19.71,62.81 17.4,65.12 17.4,66.25 16.43,67.22 16.43,69.06 R1.2
D12*
  Top 0.406: 32U4.26 24.71,42.61 20.41,38.31 15.46,38.31 Q3.1
D13*
  Top 0.406: 32U4.32 29.5,53 29.5,51.64 30.1,51.05
  Top 0.61: 30.1,51.05 R2.1
GND  (via drill 0.8, 0.8 pad 0.41, 0.8 pad 0.81, 0.9, 0.9 pad 0.61, 0.9 pad 0.81)
  Top 0.406: 22.43,60.39 32U4.15 15.8,60.41 C12.1 | 32U4.5 27.11,62.88 v27.12,62.26 | 32U4.23 22.32,51.91 v21.51,51.1 | 32U4.35 34.24,55.61 v34.66,54.95 | 32U4.43 29.86,62.01 v29.63,61.45 | X4.5 87.54,10.7 v90.85,11.85 | CU9.1 arc90 79.2,13.4 v79.2,11.07 | LDPW3.C LDPW12.C 18.49,9.47 v19.9,7.76 | 55.2,71.21 55.32,71.32 | 55.32,71.32 57.05,71.32 57.07,71.31 v57.38,71.31 | CU1.2 53.14,71.32 55.32,71.32 | R5.1 53.41,45.15 v52.71,45.85 | C16.1 59.24,46.43 v59.24,45.8 | C20.2 81.97,45.93 v83.66,47.83 | IC5.4 72.4,56.07 | 72.4,56.07 72.27,56.07 v70.52,57.82 | C23.2 84.96,57.25 v90.9,51.31 | C22.1 72.4,54.98 72.4,56.07
  Top 0.61: 22.43,60.39 v22.5,60.42 | CX2.1 7.96,63.86 v10.82,63.83 | v9.74,52.3 7.28,52.3 CX1.1 | BKLD.C 36.43,50.61 v37.71,50.61 | C10.2 34.41,66.17 v32.15,64.98 | SJ3.2 53.98,65.26 v53.09,64.36 | 55.2,71.21 C6.2 | RK7.1 35.76,52.98 v37.18,54.4 | SJ2.1 28.88,68.8 v27.83,68.21 | X3.7 X3.8 13.11,79.08 v12.29,79.89 | SJ1.1 9.78,69.45 v9.78,66.93 | C13.1 26.94,77.09 v26.78,77.26 | C5.1 74.17,68.24 v73.11,68.49 | U1.14 48.12,60.46 v47.74,60.08 | U$1.VSS 66.36,62.96 64.03,62.96 v63.33,62.26
  Top 0.813: C11.2 11.62,66.94 v9.78,66.93
  Top 1.016: 8.6,36.26 Q3.3 8.7,33.62 v9.68,32.64 | 8.55,24.24 arc90 Q2.3 8.51,21.92 v9.73,20.7 | Q1.3 arc-90 27.09,36.13 v27.09,33.9 | Q4.3 27.06,25.27 v28.78,27 | Q5.3 58.69,33.68 v58.64,33.63 | Q8.3 58.69,26.13 v59.97,27.41 | Q7.3 38.51,34.02 v39.01,33.53 | Q6.3 38.51,22.64 v38.61,22.54
  Bottom 0.406: v27.12,62.26 27.18,62.82 | 90.9,52.26 v90.9,51.31 | v90.9,51.31 90.9,50.68 | v90.85,11.85 88.33,12.67 88.63,12.67 | v79.2,11.07 arc90 78.71,10.57 78.71,10.18 | v19.9,7.76 18.99,8.95 19.86,8.08 | v57.38,71.31 57.56,71.13 | v52.71,45.85 52.71,46.05 52.93,46.27 | v59.24,45.8 59.67,46.24 59.99,46.24 | R11.1 85.69,45.09 86.67,44.12 86.68,44.12 86.79,44 88.88,44 88.89,44.02 | 70.95,58.62 70.82,58.48 | 70.82,58.48 70.66,58.32 | 90.98,47.22 90.98,47.36 91.3,47.67 | v83.66,47.83 84.38,47.61 82.93,47.61 | SJ4.1 72.28,58.48 70.82,58.48 | R19.2 95.96,13.51 95.44,14.03 94.26,14.03 | SJ6.1 71.74,56.57 71.69,56.52 | v70.52,57.82 70.29,57.82 70.27,57.84 | v90.9,51.31 91.57,51.31 91.69,51.19
  Bottom 0.5: 36.32,80.78 30.7,80.78
  Bottom 0.61: v22.5,60.42 22.9,60.41 23.23,60.07 | 14.79,77.16 14.61,76.98 | 27.18,62.82 27.6,62.4 | v9.74,52.3 9.15,52.3 | v10.82,63.83 10.62,63.85 10.48,63.98 10.22,63.59 | v21.51,51.1 21.51,50.46 21.57,50.4 | 26.93,74.48 28.03,74.48 28.17,74.63 | v34.66,54.95 34.53,54.42 34.62,54.58 | v29.63,61.45 29.3,60.44 29.71,60.49 | v37.71,50.61 38.15,50 38.15,49.62 | v53.09,64.36 53.09,63.45 53.23,63.3 53.23,63.32 | v37.18,54.4 37.18,54.57 36.94,54.82 | v12.29,79.89 12.29,80.16 12.54,80.41 | v26.78,77.26 26.21,77.26 26.16,77.32 | v73.11,68.49 72.55,67.94 72.72,67.92 | v47.74,60.08 47.32,60.08 47.13,59.89 | v63.33,62.26 | v63.33,62.26 63,61.93 | CON_ISP.GND 36.37,78.52 | 36.37,80.74 36.32,80.78 | 30.7,80.78 29.3,79.38 19.77,79.38
  Bottom 0.813: v9.78,66.93 9.74,65.66 9.85,65.69
  Bottom 1.016: v27.09,33.9 arc90 26.66,33.47 26.66,33.19 | v28.78,27 29,27 29.23,27.24 | v58.64,33.63 | v59.97,27.41 60.77,27.41 61.09,27.09 | v39.01,33.53 38.83,33.53 38.52,33.22 | v38.61,22.54 38.43,22.54 37.32,21.43 | v9.68,32.64 9.68,31.17 9.41,30.9
  Bottom 1.27: IC1.2 12.47,4.74 12.43,4.69
  pour Bottom: 4.88,85 72.93,85 72.93,52.33 95.55,52.33 95.55,-0.84 4.67,-0.84 4.67,84.96
HWB
  Top 0.406: RK7.2 30.34,52.98 32U4.33
ISP+5V
  Bottom 0.61: D2.A 36.37,74.45 CON_ISP.5V
LGND
  Top 0.406: SJ2.2 32.59,72.63 C8.1
  Top 0.61: U1.5 45.58,72.79 8.2K.1 44.84,73.54 CU2.2 | C7.2 35.36,74.09 C8.1
  pour Top: 56.91,77.59 40.54,77.59 35.69,72.73 35.69,62.38 37.39,60.67 60.36,60.67 63.17,63.49 63.17,74.86 60.66,77.37 58.22,77.35 57.89,77.55 57.34,77.53 57.14,77.55 56.95,77.55
MISO  (via drill 0.8 pad 0.81, 0.9 pad 0.61)
  Top 0.406: v30.25,74.51 33.5,77.66 37.98,77.66 39.89,79.67 52.27,79.67 52.28,79.66 59.02,79.68 61.32,77.37 61.33,77.36 77.72,77.36 78.11,76.97 78.11,74.77 77.51,74.17 73.62,74.17 72.91,73.46 72.91,71.14 71.1,69.32 69.44,69.32 68.94,68.82 68.94,66.51 67.85,65.42 U$1.SO | 32U4.11 20.97,64.61 v17.8,67.78 17.8,70.06 17.25,70.61 X3.5
  Bottom 0.406: 28.25,73.26 21,73.26 17.8,70.06 v17.8,67.78 | 28.25,73.26 30.85,73.26 CON_ISP.MISO | v30.25,74.51 29.5,74.51 28.25,73.26
MOSI  (via drill 0.8, 0.8 pad 0.81, 0.9 pad 0.61)
  Top 0.406: 32U4.10 23.11,65.8 22.31,66.6 21.25,66.6 19.12,68.73 19.12,69.78 | 19.12,69.78 19.12,70.86 18.25,71.73 X3.4 | 20.11,70.78 19.12,69.78
  Top 0.61: v29.68,72 34.31,76.62 38.16,76.62 40.41,78.78 53.06,78.78 53.22,78.78 58.59,78.76 61.35,76.1 68.95,76.1 69.73,75.32 75.64,75.32 v76.41,76.09 | v20.42,70.78 20.11,70.78 | U$1.SI 77.67,62.88 79.28,64.49 79.28,70.92 v77.86,72.35 77.66,72.54 74.78,72.54 RK4.1
  Bottom 0.61: CON_ISP.MOSI 36.83,77.25 37.92,76.16 37.92,72.48 36.13,70.69 28.29,70.69 | 28.29,70.69 23.57,70.69 22.33,71.93 21.58,71.93 v20.42,70.78 | v29.68,72 29.6,72 28.29,70.69 | v76.41,76.09 76.41,73.8 v77.86,72.35
N$1
  Top 0.406: 32U4.6 26.32,68.62 27.1,69.4 27.1,71.32
  Top 0.61: 27.1,71.32 C13.2
N$2
  Top 1.016: STEPPER1.1 52.58,37.6 52.31,37.6 | 52.31,37.6 RK12.1 | Q5.2 61,37.87 60.18,38.68 53.4,38.68 52.31,37.6
N$3
  Top 0.61: BKLD.A 34.22,50.72 R2.2
N$4
  Top 1.016: RK13.1 50.9,30.71 | 50.9,30.71 51.15,30.46 STEPPER1.3 | Q7.2 40.83,34.24 41.8,33.27 43.3,33.27 44.81,31.76 44.81,30.03 46.18,28.66 48.84,28.66 50.9,30.71
N$5
  Top 0.61: U1.3 48.12,71.43 BJ1.3 48.19,71.71 48.6,72.13 48.6,74.2 48.99,74.59 48.99,75.24 | 48.99,75.24 48.99,75.61 20K.2 | 48.99,75.24 49.07,75.32 49.07,76.95 48.73,77.29 45.62,77.29 44.66,76.34 CU2.1 41.99,76.96 40.19,76.96 38.95,75.72 C7.1
N$6  (via drill 0.8)
  Top 1.016: STEPPER1.4 51.39,27.92 RK14.1 | Q6.2 40.83,23.95 v42.82,21.96
  Bottom 1.016: v42.82,21.96 45.42,21.96 51.23,27.76 54.48,27.76 STEPPER1.4
N$7
  Top 0.203: LDPW12.A 14.14,9.45 11.86,9.45 R12.1
N$8
  Top 1.016: RK17.1 52.25,20.46 STEPPER1.6 55.66,21.82 59.07,21.82 61,23.76 Q8.2
N$9
  Top 1.016: LDM5.C RK12.2
N$10
  Top 0.61: U$1.CE 64.78,66.69 R3.1
N$11
  Top 1.016: LDM6.C RK13.2
N$12
  Top 1.016: RK14.2 48.02,26.49 LDM7.C
N$13
  Top 1.016: LDM8.C 48.05,22.59 RK17.2
N$14
  Top 1.016: Q4.2 29.37,21.4 28.26,20.29 24.49,20.29 | 24.49,20.29 20.37,20.29 19.55,21.11 19.55,21.77 RK8.1 | STEPPER.1 23.45,21.33 24.49,20.29
N$15  (via drill 0.8)
  Top 1.016: RK9.1 23.15,27.2 STEPPER.3 | Q2.2 10.82,22.42 12.32,20.93 14.32,20.93 v14.6,21.21
  Bottom 1.016: v14.6,21.21 14.6,25.85 15.93,27.18 23.13,27.18 STEPPER.3
N$16
  Top 1.016: Q3.2 arc-90 11.04,36.13 11.04,33.74 11.9,32.88 13.53,32.88 14.61,31.8 14.61,29.74 14.94,29.41 19.19,29.41 19.59,29.81 RK10.1 21.07,30.03 STEPPER.4
N$17
  Top 0.406: R9.1 55.11,46.87 R5.2 55.16,43.71 R4.2
N$18
  Bottom 0.406: R7.2 82.36,45.08 IC3.2 78.91,45.08 78.36,45.62 R10.1 77.74,47.89 77.19,48.44 72.78,48.44 D3.A 70.13,51.05 D5.C
N$19
  Top 1.016: RK11.1 22.21,36.71 | 22.21,36.71 22.65,36.71 23.39,35.97 23.39,35.17 STEPPER.6 | Q1.2 29.37,37.83 28.97,38.23 23.73,38.23 22.21,36.71
N$20
  Bottom 0.406: R13.1 82.86,49.6 82.86,50.06 83.94,51.14 87.21,51.14 88.19,50.09 88.19,50.06 88.68,49.57 88.68,46.04 C9.1
N$21
  Bottom 0.406: IC2.5 79.21,24.73 80.04,23.9 85.85,23.9 89.75,27.8 91.28,27.8 U$2.S
N$22
  Top 0.61: LDSLAVE.A 8.8,76.07 RK18.2
N$23  (via drill 0.8)
  Top 0.61: U$1.SCK 72.56,64.15 v71.61,63.75 | RK3.2 74.87,80.24 73.1,81.87 v72.4,81.85
  Bottom 0.61: v71.61,63.75 71.63,64.04 71.57,81.22 v72.4,81.85
N$24
  Top 0.61: RXLD.A 24.88,71.52 RK16.2
N$25
  Top 0.406: LDMEM.A 33.69,47.02 RK19.2
N$26
  Bottom 0.406: R15.1 R13.2 | R13.2 C19.1 | R13.2 80.93,48.66 R10.2 80.16,46.37 IC3.1
N$27
  Bottom 0.406: IC2.2 76.23,28.53 76.13,28.64 76.13,30.65 76.81,31.33 R6.1 | R6.1 82.26,29.39 R8.2 | C15.2 87.57,28.89 85.98,30.48 85.23,30.48 84.6,31.11 82.49,31.11 R6.1
N$28  (via drill 0.8)
  Top 0.406: v75.26,23.04 75.26,30.9 71.19,34.97 71.19,39.08 70.1,40.16 66.7,40.16 63.15,43.71 R4.1
  Bottom 0.406: IC2.6 IC2.7 76.12,22.18 v75.26,23.04
N$29
  Bottom 0.406: R15.2 75.42,49.5 | 75.42,49.5 TP5.P$1 | 80.16,41.26 IC3.5 80.13,41.22 78.82,41.22 78.23,41.81 78.23,43.68 77.16,44.75 77.16,47.31 76.86,47.7 68.07,47.7 | 75.42,49.5 73.72,49.5 71.57,51.64 71.57,52.72 71.32,52.97 66.48,52.97 65.81,52.3 65.81,49.97 68.07,47.7 | R16.1 66.21,47.7 68.07,47.7
N$30
  Bottom 0.406: R11.2 84.97,42.37 C17.2 | IC3.3 85.1,43.81 R11.2 | R11.2 87.82,43.29 C9.2
N$31
  Top 1.016: RK8.2 17.59,23.52 LDM4.C
N$32
  Top 1.016: LDM3.C 17.48,27.07 RK9.2
N$33
  Top 1.016: LDM2.C 17.69,33.2 RK10.2
N$34
  Top 0.406: LDPW3.A 11.66,12.03 R14.2
N$35  (via drill 0.8)
  Top 0.406: U$5.S 90.99,44.24 90.17,44.24 v82.34,36.4
  Bottom 0.406: R18.1 78.01,37.26 78.01,39.85 78.16,40 IC3.6 80.19,40.01 81.77,40.01 82.34,39.44 v82.34,36.4
N$36
  Bottom 0.406: IC3.7 80.17,37.37 R18.2 80.02,37.05 80.02,36.14 79.56,35.68 79.55,35.7 77.57,35.7 77.02,36.25 C24.1
N$37
  Top 1.016: LDM1.C RK11.2
N$38
  Top 0.61: U1.2 49.39,70.21 BJ1.1
N$39
  Top 0.61: U1.4 46.85,70.87 8.2K.2 46.87,75.71 20K.1
N$40
  Bottom 0.406: C24.2 73.57,37.07 74.27,37.76 76.89,37.76 77.02,37.9 77.02,41.11 76.86,41.27 IC3.10 | IC3.10 | R20.2 73.25,42.3 73.25,41.7 73.68,41.27 IC3.10
N$41
  Top 0.61: RK5.1 49.41,63.79 U1.15 49.39,65.4 50.6,66.61 SJ3.1
N$42
  Top 0.406: 32U4.17 13.82,58.81 X2.P$2
  Top 0.61: CX1.2 11.45,55.78 12.04,56.37 11.49,56.37 X2.P$2 9.92,57.94 RXT.2
N$43  (via drill 0.8)
  Top 0.406: v72.64,38.24 72.59,38.24 72.34,38.49 72.34,40.2 71.67,40.87 67.44,40.87 B1.~2
  Bottom 0.406: IC3.8 73.13,38.73 v72.64,38.24
N$44
  Bottom 0.406: C19.2 73.31,51.41 72.49,52.23 72.49,54.61 72.26,54.83 70.88,54.83 D3.C 68.31,54.89 D5.A
N$45
  Top 0.406: C21.1 77.97,56.11 IC5.3
N$46
  Top 0.406: C21.2 75.52,58.33 76.78,57.07 76.78,54.49 76.56,54.27 75.53,54.27 IC5.5
N$47
  Top 0.406: C18.1 63.29,54.03 | 63.29,54.03 63.17,54.16 61.97,54.16 61.58,54.55 B1.- | 63.29,54.03 63.85,54.03 R23.1 65.58,49.64 64.8,48.85 R17.1
N$48  (via drill 0.8)
  Top 0.406: v68.23,42.2 67.66,42.2 57.38,52.48 57.38,54.58 56.61,55.35 55.55,55.35 B1.~1
  Bottom 0.406: IC3.9 73.02,40 R21.1 73.01,40.45 71.65,41.81 68.62,41.81 v68.23,42.2
N$49
  Top 0.406: B1.+ 61.58,51.45 62.18,50.85 C18.2 62.83,50.01 R17.2 62.83,48.83 R22.1
N$50  (via drill 0.8)
  Top 0.406: R22.2 68.99,44.48 v69.64,44.48
  Bottom 0.406: v69.64,44.48 70.88,44.48 71.29,44.07 74.72,44.07 arc-90 IC3.12
N$51  (via drill 0.8)
  Top 0.406: R24.2 65.59,55.15 R23.2 66.95,54.1 70.6,50.46 v70.6,46.2
  Bottom 0.406: IC3.13 71.72,45.08 v70.6,46.2
N$52
  Top 0.406: RXLD1.A 19.6,50.13 21.37,48.36 21.37,46.54 RK15.2
RESET  (via drill 0.8 pad 0.81)
  Top 0.406: 32U4.13 19.05,62.01 16.43,64.63 16.43,65.75 15.13,67.05
  Top 0.61: 14.69,66.92 C11.1 | C11.1 14.56,68.25 13.38,69.43 11.43,69.43 SJ1.2 11.35,71.86 RK6.1 12.49,71.86 v13.67,73.01 | 15.13,67.05 14.58,67.05 C11.1
  Bottom 0.61: CON_ISP.RESET 19.15,78.52 v13.67,73.01
RX  (via drill 0.8, 0.9 pad 0.61)
  Top 0.406: 32U4.20 20.48,56.38 17.04,56.38 16.48,55.82 16.48,53.58 15.88,52.98 v15.88,49.61 | v53.68,58.07 57.93,58.07 59.47,59.62 66.34,59.62 v66.78,60.06 | v27.8,41.81 28.49,41.79 29.48,41.8 37.65,41.8 39.54,43.69 44.37,43.69 v44.82,44.63
  Bottom 0.406: v53.68,58.07 53.08,58.68 52.09,58.68 49.33,61.44 47.16,61.44 45.21,59.49 45.2,59.49 43.41,57.71 43.41,50.73 44.76,49.5 44.76,45.18 v44.82,44.63 | v15.88,49.61 15.88,48.78 19.41,45.24 24.15,45.24 v27.8,41.81 | v66.78,60.06 67.04,60.32 75.35,60.32 U100.P$6
RXLED
  Top 0.406: 32U4.8 24.71,67.72
  Top 0.61: 24.71,67.72 RXLD.C
SCK  (via drill 0.8 pad 0.81, 0.9 pad 0.61)
  Top 0.406: 32U4.9 23.91,66.54 21.26,69.19 21.26,69.71 21.87,70.32 21.87,71.25 19.25,73.87 19.25,77.84 | X3.3 19.25,77.84 | 20.79,76.29 19.25,77.84
  Top 0.61: v20.84,76.29 20.79,76.29 | RK3.1 71.64,78.64 61.56,78.64 58.51,81.69 32.01,81.69 29.82,79.5 v29.82,77.2
  Bottom 0.61: 28.26,75.79 31.27,75.79 32.68,77.2 33.52,77.2 CON_ISP.SCK | v29.82,77.2 29.68,77.2 28.26,75.79 | 28.26,75.79 21.35,75.79 v20.84,76.29
SCL  (via drill 0.8, 0.8 pad 0.81)
  Top 0.406: RK2.2 11.6,54.08 11.8,54.29 13.07,54.29 14.37,55.59 14.37,57.11 15.27,58.01 32U4.18 20.53,58.01 21.69,58.01 22.52,58.85 v23.57,58.85 | 58.65,7.33 58.65,8.92 56.09,11.48 53.75,11.48 49.41,15.82 34.25,15.82 33.31,16.75 33.31,24.46 33.83,24.98 33.83,39.46 v32.4,40.42 | 58.65,7.33 58.65,6.97 57.4,5.72 55.96,5.72 J2.SCL | J1.SCL 72.92,6.06 71.9,7.17 58.92,7.17 58.65,7.33
  Bottom 0.406: 23.57,58.68 23.77,58.68 24.9,57.55 24.9,49.99 32.4,42.48 v32.4,40.42
  Bottom 0.61: v23.57,58.85 23.57,58.68
SDA  (via drill 0.8, 0.8 pad 0.81)
  Top 0.406: RK1.2 15.4,54.09 15.4,56.48 16.13,57.21 32U4.19 20.53,57.23 v23.03,57.23 | 38.09,14.95 39.43,14.95 | 39.43,14.95 48.23,14.95 50.3,12.88 | 50.3,12.88 J2.SDA | J1.SDA 71.88,9.5 73,10.62 75.12,10.62 76.26,9.48 76.26,6.68 74.05,4.47 71.74,4.47 68.3,1.02 51.53,1.02 50.3,2.25 50.3,12.88 | v30.78,33.08 30.78,32.8 31.98,31.6 31.98,27.22 30.52,25.77 30.52,21.59 32.38,19.74 32.38,16.07 33.48,14.96 39.42,14.96 39.43,14.95
  Bottom 0.406: 23.07,57.23 23.07,50.49 30.56,43 30.56,33.3 v30.78,33.08
  Bottom 0.61: v23.03,57.23 23.07,57.23
TX  (via drill 0.8, 0.9 pad 0.61)
  Top 0.406: 32U4.21 20.48,55.57 17.89,55.57 17.36,55.04 v17.36,50.84 | v55.56,59.83 58.17,59.83 58.92,60.58 64.17,60.58 v65.17,61.57 | v43.43,46.76 v43.43,46.75 41.24,44.56 38.1,44.56 36.08,42.54 29.65,42.54 28.26,43.93 v27.76,43.93
  Bottom 0.203: v17.36,50.84 17.34,50.91 17.34,50.83
  Bottom 0.406: v55.56,59.83 52.32,59.83 49.8,62.34 46.75,62.34 43.46,59.06 43.46,59.05 42.55,58.14 42.55,50.54 43.75,49.34 43.75,47.08 v43.43,46.75 | v65.17,61.57 75.53,61.57 U100.P$7 | 17.34,50.83 17.34,48.5 19.49,46.36 25.33,46.36 v27.76,43.93
TXLED
  Top 0.406: RXLD1.C 19.48,53.77 32U4.22
USB_N  (via drill 0.3)
  Top 0.203: RUSB1.1 85.33,16.82 85.66,17.14
  Top 0.406: v29.12,66.52 28.71,66.12 32U4.3 | 86.11,16.53 85.66,16.98 85.66,17.14 85.66,18.47 84.94,19.19 68.82,19.19 68.22,19.79 v68.22,38.29
  Bottom 0.406: v29.12,66.52 29.36,66.76 32.8,66.76 33.63,65.93 33.63,61.56 35.84,59.35 40.65,59.35 40.65,61.13 43.71,64.2 47.93,64.2 50,66.27 54.4,66.27 61.91,58.76 61.91,42.01 64.77,39.15 67.36,39.15 v68.22,38.29
USB_P  (via drill 0.3)
  Top 0.406: v27.93,66.68 27.93,64.62 32U4.4 | 88.89,16.88 RUSB2.1 88.65,17.96 86.76,19.84 69.56,19.85 69.28,20.14 v69.28,38.3
  Bottom 0.406: v27.93,66.68 28.66,67.42 33.07,67.42 34.29,66.2 34.29,61.83 36.12,60 39.99,60 39.99,61.41 43.44,64.85 47.66,64.85 49.84,67.04 54.57,67.04 62.57,59.03 62.57,42.34 64.88,40.03 68.62,40.03 69.28,39.37 v69.28,38.3
USBC_N
  Top 0.406: X4.2 85.14,13.6 RUSB1.2
USBC_P
  Top 0.406: X4.3 85.94,10.91 87.24,12.21 88.21,12.21 88.65,12.66 RUSB2.2
VUSB  (via drill 0.8, 0.8 pad 0.81)
  Top 0.406: 32U4.7 25.52,61.49 26.02,60.98 26.02,58.43 v28.76,56.88 | 72.44,13.57 71.87,13.57 70.59,12.29 54.31,12.29 49.88,16.73 34.91,16.73 34.2,17.44 34.2,24.04 34.68,24.52 34.68,39.26 35.93,40.51 38.52,40.51 v39.04,41.03 | CU9.2 84.34,11.28 X4.1
  Top 0.61: CU9.2 82.11,15.19 81.23,16.07 78.22,16.07 75.71,13.57 72.44,13.57 68.31,13.57 66.95,14.94 v66.95,15.92
  Bottom 0.406: v28.76,56.88 29.02,56.23 29.02,51.05 v39.04,41.03
  Bottom 0.61: v66.95,15.92 57.69,15.92 D4.A
XTAL1
  Top 0.406: 32U4.16 13.48,59.61
  Top 0.61: 13.48,59.61 X2.P$1 | X2.P$1 6.97,61.65 CX2.2 | RXT.1 9.62,59.84 X2.P$1

### Text on the board
tNames: SPI | D11 | Rx | pH V5.0 | pH V5.0 | IF LoRa | Tx | I2C P-ups / Don't solder / If Slave | BLK | OPT | MEM SELECT | OPT | pH V5.0 | 3V3 | 12V
bNames: LoRa RN2483
tValues: Screen | PID
203bmp: C:/Users/G/Pictures/logo_epfl.bmp